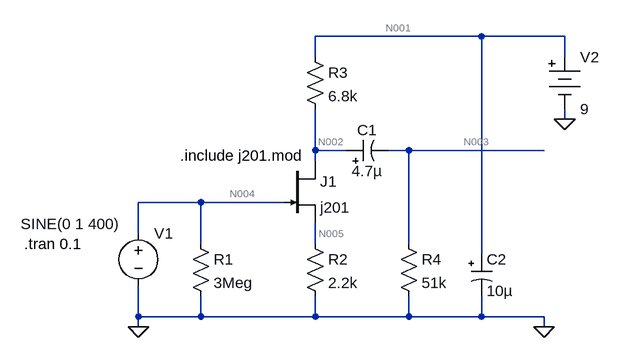
[diagram p0: schematic preamp.asc]
preamp.asc, the LTspice schematic file:
Version 4
SHEET 1 972 680
WIRE 784 64 528 64
WIRE 912 64 784 64
WIRE 528 96 528 64
WIRE 912 96 912 64
WIRE 912 192 912 176
WIRE 528 240 528 176
WIRE 576 240 528 240
WIRE 672 240 640 240
WIRE 880 240 672 240
WIRE 528 256 528 240
WIRE 352 320 256 320
WIRE 480 320 352 320
WIRE 256 368 256 320
WIRE 352 384 352 320
WIRE 528 384 528 352
WIRE 672 384 672 240
WIRE 784 400 784 64
WIRE 256 496 256 448
WIRE 352 496 352 464
WIRE 352 496 256 496
WIRE 528 496 528 464
WIRE 528 496 352 496
WIRE 672 496 672 464
WIRE 672 496 528 496
WIRE 784 496 784 464
WIRE 784 496 672 496
WIRE 880 496 784 496
WIRE 256 512 256 496
WIRE 880 512 880 496
FLAG 880 512 0
FLAG 912 192 0
FLAG 256 512 0
SYMBOL njf 480 256 R0
SYMATTR InstName J1
SYMATTR Value j201
SYMBOL res 336 368 R0
SYMATTR InstName R1
SYMATTR Value 3Meg
SYMBOL res 512 368 R0
SYMATTR InstName R2
SYMATTR Value 2.2k
SYMBOL res 512 80 R0
SYMATTR InstName R3
SYMATTR Value 6.8k
SYMBOL res 656 368 R0
SYMATTR InstName R4
SYMATTR Value 51k
SYMBOL polcap 576 256 R270
WINDOW 0 32 32 VTop 2
WINDOW 3 0 32 VBottom 2
SYMATTR InstName C1
SYMATTR Value 4.7µ
SYMBOL polcap 768 400 R0
SYMATTR InstName C2
SYMATTR Value 10µ
SYMBOL voltage 256 352 R0
WINDOW 3 -181 1 Left 2
SYMATTR InstName V1
SYMATTR Value SINE(0 1 400)
SYMBOL Misc/battery 912 80 R0
SYMATTR InstName V2
SYMATTR Value 9
TEXT 320 248 Left 2 !.include j201.mod
TEXT 80 384 Left 2 !.tran 0.1

The netlist it stands for:
* preamp.asc
J1 N002 N004 N005 j201
R1 N004 0 3Meg
R2 N005 0 2.2k
R3 N001 N002 6.8k
R4 N003 0 51k
C1 N002 N003 4.7µ
C2 N001 0 10µ
V1 N004 0 SINE(0 1 400)
V2 N001 0 9
.model NJF NJF
.model PJF PJF
.lib standard.jft
.include j201.mod
.tran 0.1
.backanno
.end

* Results of the author's LTspice run, read from the files saved beside the schematic
* Operating Point, zero values left out:
*   V(n002) = 8.047 V
*   V(n005) = 308.3 mV
*   V(n001) = 9 V
*   Id(J1) = 140.2 µA
*   Ig(J1) = -11.88 pA
*   Is(J1) = -140.2 µA
*   I(R3) = 140.2 µA
*   I(R2) = 140.2 µA
*   I(V2) = -140.2 µA
*   I(V1) = 11.88 pA
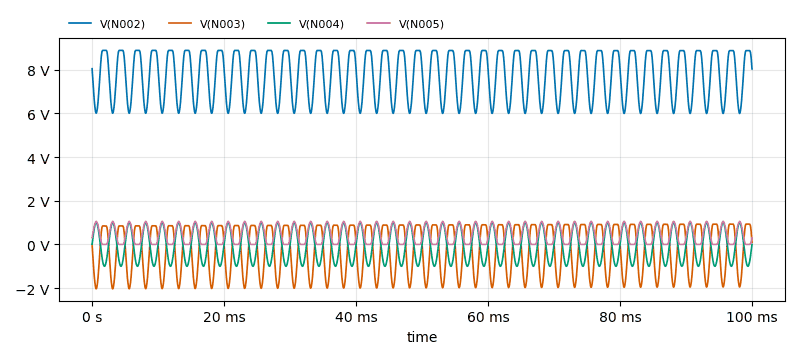
[diagram p1: Transient Analysis of preamp.asc, plotted from the saved traces]
* Transient Analysis, 1 run:
*   V(N002): min 5.997 V, max 8.887 V, average 7.749 V, rms 7.825 V, last 8.036 V
*   V(N003): min -2.032 V, max 931.8 mV, average -242.5 mV, rms 1.115 V, last 89.2 mV
*   V(N004): min -1 V, max 1 V, average 0 V, rms 707.9 mV, last 0 V
*   V(N005): min -6.028 µV, max 1.056 V, average 415.3 mV, rms 575.7 mV, last 308.3 mV